# Altium project Sharif_EE2LAB_Project.PrjPcb
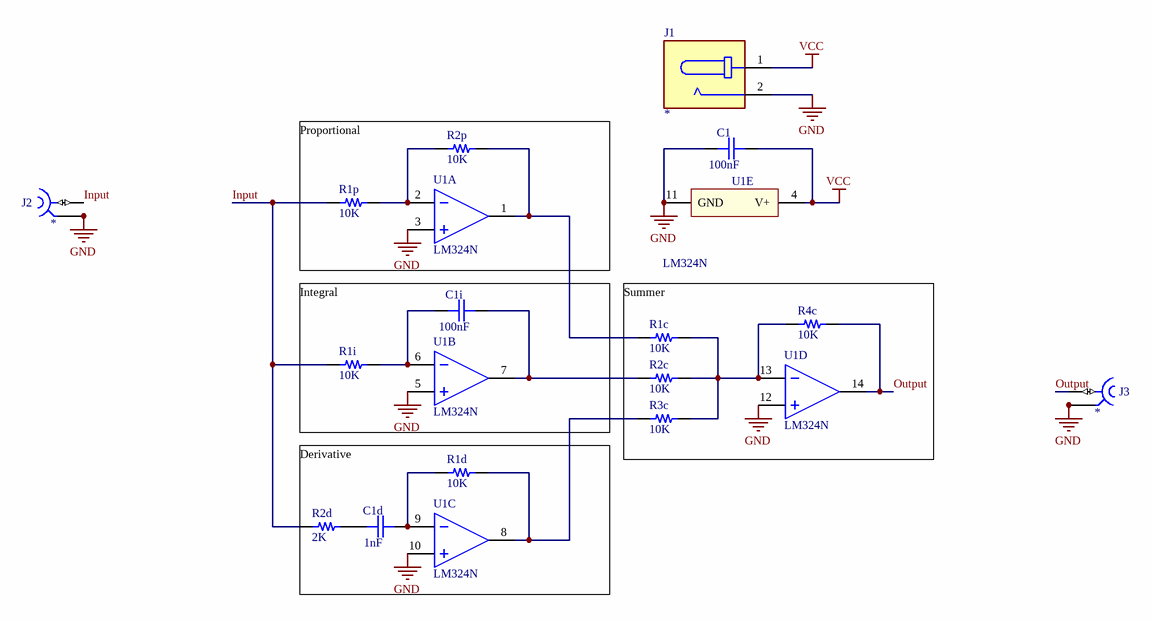
[diagram p0: Schematics.SchDoc]
1 sheet, 16 parts. Net scope: global (net labels, ports and power ports of the same name join across sheets).
Board file: PCB.PcbDoc

## Sheet Schematics.SchDoc: PID Project
size 297 x 209 mm; EDA_Number: EDA-XXXXX-VX-X; DivGrp: TE/MPE; CheckedBy: -; DrawnBy: DrawnBy; Organization: Sharif Institude of Technology; Revision: -; SheetNumber: 1; SheetTotal: 1; Projet: -; ModifiedBy: -; CreateDate: XX/XX/XXXX; CheckedDate: -; Title2: Sharif; Designer: Nima Mosaddegh; SN: 402102432; ModifiedDate: -

### Parts
C1  100nF  [CAPC4720X215N]
C1d  1nF  [CAPC4720X215N]
C1i  100nF  [CAPC4720X215N]
J1  *  [CUI_PJ-037B]
J2  *  [LINX_CONSMA002-L-G]
J3  *  [LINX_CONSMA002-L-G]
R1c  10K  [RES1016-650X250]
R1d  10K  [RES1016-650X250]
R1i  10K  [RES1016-650X250]
R1p  10K  [RES1016-650X250]
R2c  10K  [RES1016-650X250]
R2d  2K  [RES1016-650X250]
R2p  10K  [RES1016-650X250]
R3c  10K  [RES1016-650X250]
R4c  10K  [RES1016-650X250]
U1  LM324N  [N0014A]  (parts A,B,C,D,E of 5)

### Nets
GND: C1.1 J1.2 J2.S1 J2.S2 J2.S3 J2.S4 J3.S1 J3.S2 J3.S3 J3.S4 U1.3(IN1+) U1.5(IN2+) U1.10(IN3+) U1.11(GND) U1.12(IN4+)
VCC: C1.2 J1.1 U1.4(V+)
Input: J2.1 R1i.1 R1p.1 R2d.1
Output: J3.1 R4c.2 U1.14(OUT4)
NetC1d_1: C1d.1 R2d.2
NetC1d_2: C1d.2 R1d.1 U1.9(IN3-)
NetC1i_1: C1i.1 R1i.2 U1.6(IN2-)
NetC1i_2: C1i.2 R2c.1 U1.7(OUT2)
NetR1c_1: R1c.1 R2p.2 U1.1(OUT1)
NetR1c_2: R1c.2 R2c.2 R3c.2 R4c.1 U1.13(IN4-)
NetR1d_2: R1d.2 R3c.1 U1.8(OUT3)
NetR1p_2: R1p.2 R2p.1 U1.2(IN1-)

### Notes on the sheet
- Proportional
- Integral
- Summer
- Derivative
- Designer:
- SN:
- Print Date
- Sheet
- Size
- A4
- of
- Rev

### Library data of the parts
C1 C1d C1i = Capacitor: Non-polarised capacitor
  C1 C1i: Value: 100nF
  C1d: Value: 1nF
J1 = DC Power Jack Connector: 2.5 x 6.5 mm, 2.5 A, Horizontal, Through Hole, Dc Power Jack Connector; Value: *
J2 J3 = Coax_1Female_1Shield: SMA Jack 50 Ohm PCB Through Hole; Value: *
R1c R1d R1i R1p R2c R2d R2p R3c R4c = Resistor
  R1c R1d R1i R1p R2c R2p R3c R4c: Value: 10K
  R2d: Value: 2K
U1 = LM324N: Low Power Quad Operational Amplifier, 14-pin MDIP; Manufacturer: Texas Instruments; ComponentLink1Description: Datasheet URL; ComponentLink1URL: http://www.ti.com/general/docs/lit/getliterature.tsp?genericPartNumber=LM324&fileType=pdf